# Altium schematic sheet Beleuchtung_ESP.SchDoc: Steuerung Beleuchtung
size A4; Date: 10.11.2025; Author: Alexander Schiechtl; Revision: v1.0; SheetNumber: 6; SheetTotal: 7; Project: 3D-Scanner
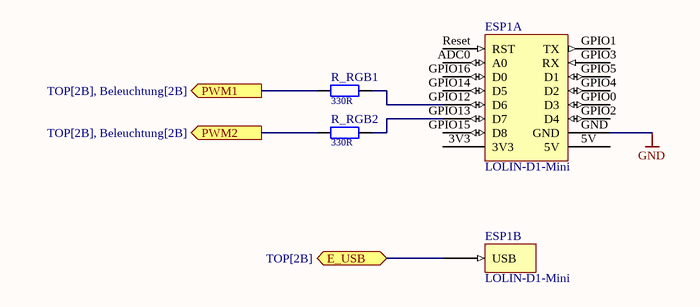
[diagram p0: Beleuchtung_ESP.SchDoc]

## Parts
ESP1  LOLIN-D1-Mini  (parts A,B of 2)
R_RGB1  330R  [R_0207/RM4]
R_RGB2  330R  [R_0207/RM4]

## Ports
E_USB (bidir, see TOP[2B]), PWM1 (out, see TOP[2B], Beleuchtung[2B]), PWM2 (out, see TOP[2B], Beleuchtung[2B])

## Nets
GND: ESP1.GND
E_USB: ESP1.?1(USB) ; port E_USB
PWM1: R_RGB1.2 ; port PWM1
PWM2: R_RGB2.2 ; port PWM2
NetESP1_GPIO12: ESP1.GPIO12(D6) R_RGB1.1
NetESP1_GPIO13: ESP1.GPIO13(D7) R_RGB2.1

Not connected (* = marked no-connect by the designer): ESP1 3V3 5V ADC0(A0) GPIO0(D3) GPIO1(TX) GPIO2(D4) GPIO3(RX) GPIO4(D2) GPIO5(D1) GPIO14(D5) GPIO15(D8) GPIO16(D0) Reset(RST)

## Notes on the sheet
- Project:
- Title:
- Leitner AG
- Zona Artigianale Est 7
- 39040 Racines BZ
- Italy
- Confidential
- Author:
- Document name:
- Date:
- Version:
- Size:
- A4

## Library data of the parts
R_RGB1 R_RGB2 = R: Resistor; Usage: only permitted for non-commercial purposes at HTL I Innsbruck; Published: 21-Feb-2011; LatestRevisionDate: 07-Sep-2019; Value: 330R